# EAGLE schematic Front ECU rev8 (EAGLE 9.1.3)
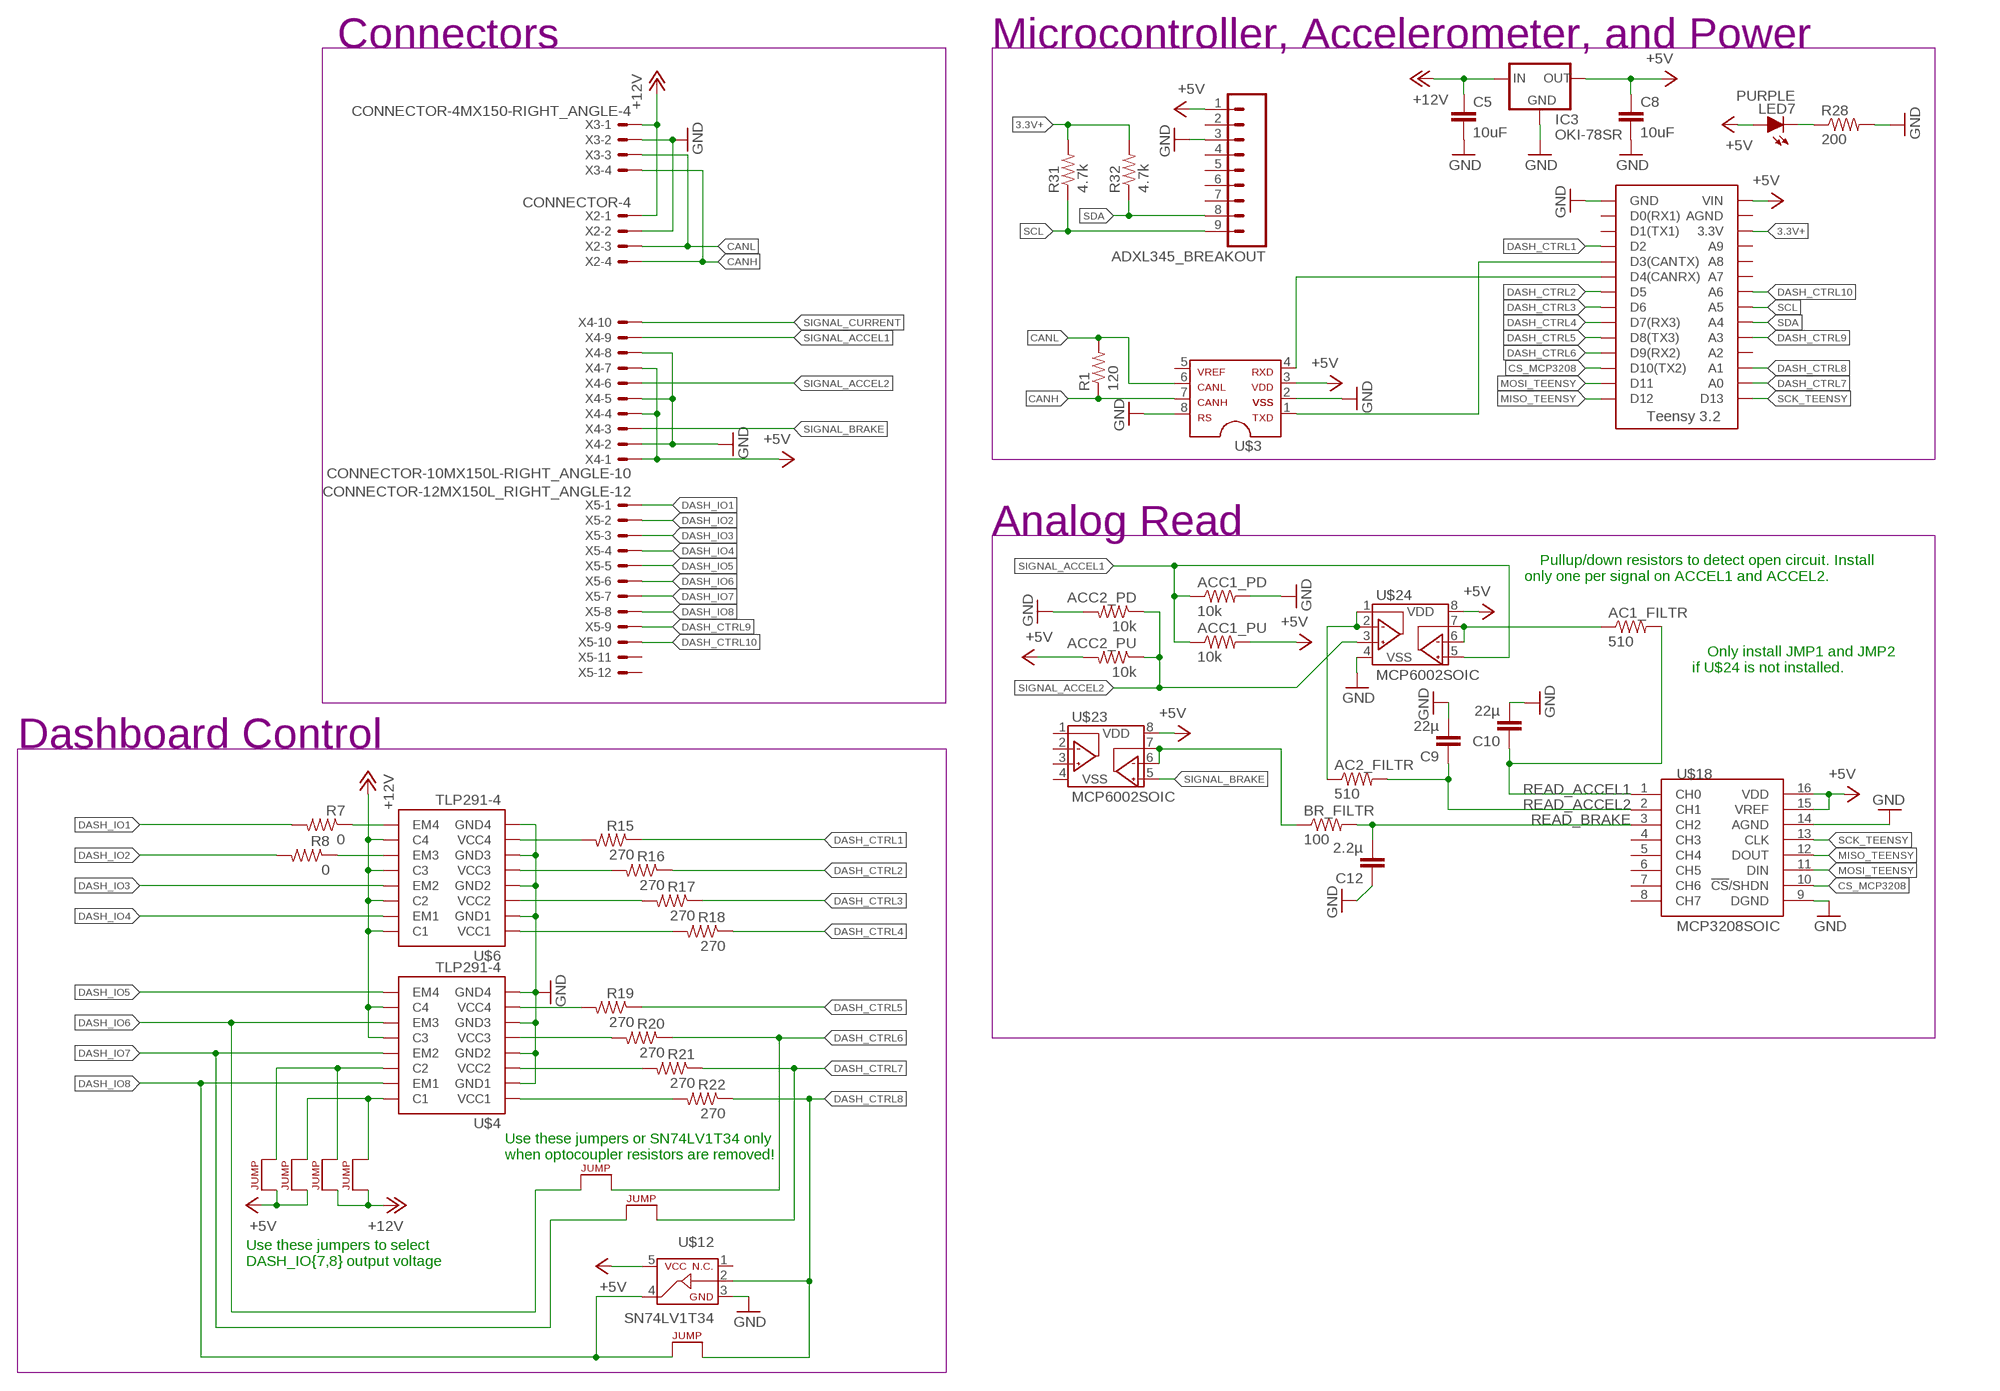
[diagram p0: schematic, sheet 1]

## Parts
AC1_FILTR  510  RESISTOR0805-RES  [0805]
AC2_FILTR  510  RESISTOR0805-RES  [0805]
ACC1_PD  10k  RESISTOR0805-RES  [0805]
ACC1_PU  10k  RESISTOR0805-RES  [0805]
ACC2_PD  10k  RESISTOR0805-RES  [0805]
ACC2_PU  10k  RESISTOR0805-RES  [0805]
ADXL345_BREAKOUT  M09  [1X09]
BR_FILTR  100  RESISTOR0805-RES  [0805]
C5  10uF  CAP0805  [0805]
C8  10uF  CAP0805  [0805]
C9  22µ  CAP0805  [0805]
C10  22µ  CAP0805  [0805]
C12  2.2µ  CAP0805  [0805]
IC3  OKI-78SR  [OKI-78SR]
LED7  PURPLE  LED-0805  [LED-805]
R1  120  RESISTOR0805-RES  [0805]
R7  0  RESISTOR0805-RES  [0805]
R8  0  RESISTOR0805-RES  [0805]
R15  270  RESISTOR0805-RES  [0805]
R16  270  RESISTOR0805-RES  [0805]
R17  270  RESISTOR0805-RES  [0805]
R18  270  RESISTOR0805-RES  [0805]
R19  270  RESISTOR0805-RES  [0805]
R20  270  RESISTOR0805-RES  [0805]
R21  270  RESISTOR0805-RES  [0805]
R22  270  RESISTOR0805-RES  [0805]
R28  200  RESISTOR0805-RES  [0805]
R31  4.7k  RESISTOR0805-RES  [0805]
R32  4.7k  RESISTOR0805-RES  [0805]
U$1  TEENSY_3.2_SIMPLE  [TEENSY_3.2_SIMPLE]
U$3  MCP2551  [SOIC-08]
U$4  TLP291-4  [SOIC-16]
U$6  TLP291-4  [SOIC-16]
U$7  JUMPER  [0805]
U$8  JUMPER  [0805]
U$9  JUMPER  [0805]
U$12  SN74LV1T34  [SOT-23-5]
U$18  MCP3208SOIC  [SOIC-16]
U$19  JUMPER  [0805]
U$20  JUMPER  [0805]
U$21  JUMPER  [0805]
U$22  JUMPER  [0805]
U$23  MCP6002SOIC  [SOIC-08]
U$24  MCP6002SOIC  [SOIC-08]
X2  CONNECTOR-4  [MINIFIT_5566-4]
X3  CONNECTOR-4MX150-RIGHT_ANGLE-4  [MX150L_RIGHT_ANGLE-4]
X4  CONNECTOR-10MX150L-RIGHT_ANGLE-10  [MX150L_RIGHT_ANGLE-10]
X5  CONNECTOR-12MX150L_RIGHT_ANGLE-12  [MX150L_RIGHT_ANGLE-12]

## Nets
3.3V+: R31.2 R32.2 U$1.3.3V
+5V: ACC1_PU.2 ACC2_PU.2 ADXL345_BREAKOUT.1 C8.1 IC3.3(OUT) LED7.A U$1.VIN U$3.3 U$12.5 U$18.15(VREF) U$18.16(VDD) U$20.1 U$22.1 U$23.8(VDD) U$24.8(VDD) X4.1 X4.4 X4.7
+12V: C5.1 IC3.1(IN) U$4.10(C4) U$4.12(C3) U$6.10(C4) U$6.12(C3) U$6.14(C2) U$6.16(C1) U$9.1 U$21.1 X2.1 X3.P$1
CANH: R1.1 U$3.7 X2.4 X3.P$4
CANL: R1.2 U$3.6 X2.3 X3.P$3
CS_MCP3208: U$1.D10(TX2) U$18.10(!CS!/SHDN)
DASH_CTRL1: R15.1 U$1.D2
DASH_CTRL2: R16.1 U$1.D5
DASH_CTRL3: R17.1 U$1.D6
DASH_CTRL4: R18.1 U$1.D7(RX3)
DASH_CTRL5: R19.1 U$1.D8(TX3)
DASH_CTRL6: R20.1 U$1.D9(RX2) U$7.2
DASH_CTRL7: R21.1 U$1.A0 U$8.2
DASH_CTRL8: R22.1 U$1.A1 U$12.2 U$19.2
DASH_CTRL9: U$1.A3 X5.9
DASH_CTRL10: U$1.A6 X5.10
DASH_IO1: R7.2 X5.1
DASH_IO2: R8.2 X5.2
DASH_IO3: U$6.13(EM2) X5.3
DASH_IO4: U$6.15(EM1) X5.4
DASH_IO5: U$4.9(EM4) X5.5
DASH_IO6: U$4.11(EM3) U$7.1 X5.6
DASH_IO7: U$4.13(EM2) U$8.1 X5.7
DASH_IO8: U$4.15(EM1) U$12.4 U$19.1 X5.8
GND: ACC1_PD.2 ACC2_PD.2 ADXL345_BREAKOUT.3 C5.2 C8.2 C9.2 C10.2 C12.1 IC3.2(GND) R28.2 U$1.GND U$3.2 U$3.8 U$4.2(GND1) U$4.4(GND2) U$4.6(GND3) U$4.8(GND4) U$6.2(GND1) U$6.4(GND2) U$6.6(GND3) U$6.8(GND4) U$12.3 U$18.9(DGND) U$18.14(AGND) U$24.4(VSS) X2.2 X3.P$2 X4.2 X4.5 X4.8
MISO_TEENSY: U$1.D12 U$18.12(DOUT)
MOSI_TEENSY: U$1.D11 U$18.11(DIN)
N$1: R7.1 U$6.9(EM4)
N$2: U$1.D4(CANRX) U$3.4
N$3: R8.1 U$6.11(EM3)
N$4: U$4.16(C1) U$9.2 U$20.2
N$5: U$1.D3(CANTX) U$3.1
N$6: U$4.14(C2) U$21.2 U$22.2
N$11: BR_FILTR.1 U$23.6(VINB-) U$23.7(VOUTB)
N$13: AC2_FILTR.1 U$24.1(VOUTA) U$24.2(VINA-)
N$17: AC1_FILTR.1 U$24.6(VINB-) U$24.7(VOUTB)
N$19: R15.2 U$6.7(VCC4)
N$24: R16.2 U$6.5(VCC3)
N$27: R21.2 U$4.3(VCC2)
N$28: R17.2 U$6.3(VCC2)
N$29: R18.2 U$6.1(VCC1)
N$31: R19.2 U$4.7(VCC4)
N$32: R20.2 U$4.5(VCC3)
N$35: R22.2 U$4.1(VCC1)
N$61: LED7.C R28.1
READ_ACCEL1: AC1_FILTR.2 C10.1 U$18.1(CH0)
READ_ACCEL2: AC2_FILTR.2 C9.1 U$18.2(CH1)
READ_BRAKE: BR_FILTR.2 C12.2 U$18.3(CH2)
SCK_TEENSY: U$1.D13 U$18.13(CLK)
SCL: ADXL345_BREAKOUT.9 R31.1 U$1.A5
SDA: ADXL345_BREAKOUT.8 R32.1 U$1.A4
SIGNAL_ACCEL1: ACC1_PD.1 ACC1_PU.1 U$24.5(VINB+) X4.9
SIGNAL_ACCEL2: ACC2_PD.1 ACC2_PU.1 U$24.3(VINA+) X4.6
SIGNAL_BRAKE: U$23.5(VINB+) X4.3
SIGNAL_CURRENT: X4.10
Unconnected: ADXL345_BREAKOUT.2 ADXL345_BREAKOUT.4 ADXL345_BREAKOUT.5 ADXL345_BREAKOUT.6 ADXL345_BREAKOUT.7 U$1.A2 U$1.A7 U$1.A8 U$1.A9 U$1.AGND U$1.D0(RX1) U$1.D1(TX1) U$3.5 U$12.1 U$18.4(CH3) U$18.5(CH4) U$18.6(CH5) U$18.7(CH6) U$18.8(CH7) U$23.1(VOUTA) U$23.2(VINA-) U$23.3(VINA+) U$23.4(VSS) X5.11 X5.12

## Notes on the sheet
- Connectors | Microcontroller, Accelerometer, and Power
- Analog Read
- ⇦ Pullup/down resistors to detect open circuit. Install
  only one per signal on ACCEL1 and ACCEL2.
- ⇦ Only install JMP1 and JMP2
  if U$24 is not installed.
- Dashboard Control
- Use these jumpers or SN74LV1T34 only
  when optocoupler resistors are removed!
- Use these jumpers to select
  DASH_IO{7,8} output voltage

## Library data of the parts
AC1_FILTR AC2_FILTR ACC1_PD ACC1_PU ACC2_PD ACC2_PU BR_FILTR R1 R7 R8 R15-R22 R28 R31 R32 = HyTechDevices:RESISTOR: Resistor Basic schematic elements and footprints for 0603, 1206, and PTH resistors.
ADXL345_BREAKOUT = HyTechDevices:M09: Standard 9-pin 0.1" header. Source: Sparkfun <https://github.com/sparkfun/SparkFun-Eagle-Libraries>
C5 C8-C10 C12 = HyTechDevices:CAP: Capacitor Standard 0603 ceramic capacitor, and 0.1" leaded capacitor.
IC3 = HyTechDevices:OKI-78SR: Murata OKI-78SR Non-Isolated Switching Regulator DC/DC - Datasheet <https://power.murata.com/data/power/oki-78sr.pdf>
LED7 = HyTechDevices:LED: Light Emitting Diode (LED) Source: Dangerous Prototypes Eagle Library <https://github.com/DangerousPrototypes/Eagle_Part_Library>
U$1 = HyTechDevices:TEENSY_3.2_SIMPLE: Simple version of the Teensy 3.2 board that only uses the 2 main rows of pins, not the inner pins or the pins opposite the usb port.
U$3 = HyTechDevices:MCP2551: MCP2551 High-Speed CAN Transceiver Product Webpage <https://www.microchip.com/wwwproducts/en/MCP2551> Datasheet <http://ww1.microchip.com/downloads/en/DeviceDoc/21667f.pdf> This device is outdated It is replaced by MCP2561. Comparison Page <https://www.microchip.com/wwwproducts/ProductCompare/MCP2551/MCP2561> Product Webpage <https://www.microchip.com/wwwproducts/en/MCP2561> Datasheet <http://ww1.microchip.com/downloads/en/DeviceDoc/20005167C.pdf>
U$4 U$6 = HyTechDevices:TLP291-4: Toshiba Quad Channel Optocoupler TLP291-4
U$7-U$9 U$19-U$22 = HyTechDevices:JUMPER: Jumper for changing operation of a device
U$12 = HyTechDevices:SN74LV1T34: TI SN74LV1T34 Single Power Supply Single Buffer GATE CMOS Logic Level Shifter Datasheet <http://www.ti.com/lit/ds/symlink/sn74lv1t34.pdf>
U$18 = HyTechDevices:MCP3208: Analog to Digital Converter
U$23 U$24 = HyTechDevices:MCP6002: Microchip MCP6002 Dual Channel Op Amp
X2 = HyTechDevices:CONNECTOR-4: Mini-Fit Junior connector 4 pole Source: http://www.molex.com; OC_FARNELL: unknown; OC_NEWARK: unknown
X3 = HyTechDevices:CONNECTOR-4: Mini-Fit Junior connector 4 pole Source: http://www.molex.com
X4 = HyTechDevices:CONNECTOR-10: Mini-Fit Junior connector 10 pole Source: http://www.molex.com
X5 = HyTechDevices:CONNECTOR-12: Mini-Fit Junior connector 12 pole Source: http://www.molex.com